# Altium schematic sheet CS_JFETOnSemiSOT23_Simple_v1.SchDoc
size A4
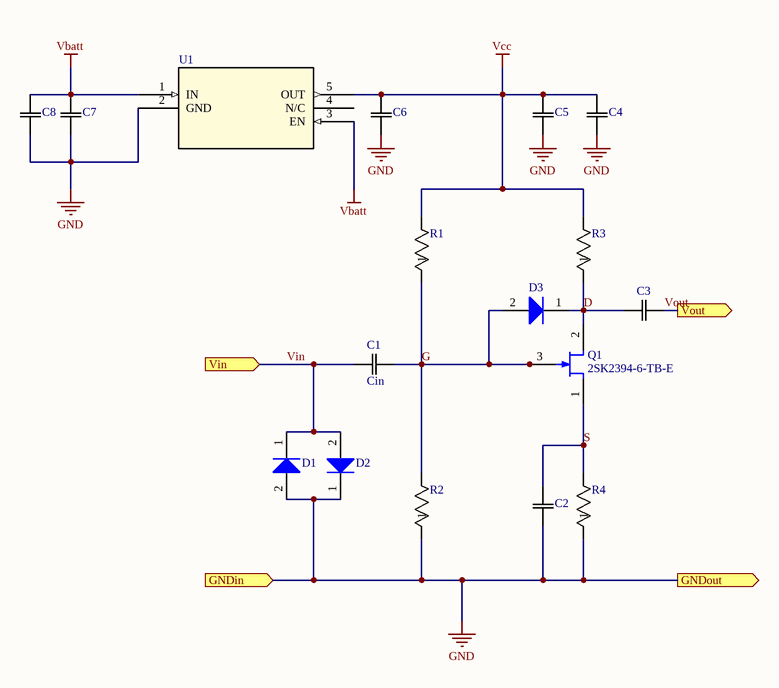
[diagram p0: CS_JFETOnSemiSOT23_Simple_v1.SchDoc]

## Parts
C1  Cin  [C0201]
C2  (no value)  [C0201]
C3  (no value)  [C0201]
C4  (no value)  [CAP_CBR_0201]
C5  (no value)  [CAP_CBR_0201]
C6  (no value)  [YAG_CC0402]
C7  (no value)  [YAG_CC0402]
C8  (no value)  [YAG_CC0402]
D1  (no value)  [INF-SOD323_V]
D2  (no value)  [INF-SOD323_V]
D3  (no value)  [INF-SOD323_V]
Q1  2SK2394-6-TB-E  [ONSC-CP-3-318AN_A_V]
R1  (no value)  [RES_RC0201_P6XP3]
R2  (no value)  [RES_RC0201_P6XP3]
R3  (no value)  [RES_RC0201_P6XP3]
R4  (no value)  [RES_RC0201_P6XP3]
U1  (no value)  [DBV5]

## Ports
GNDin (in), GNDout (out), Vin (in), Vout (out)

## Nets
GND: C2.1 C4.1 C5.1 C6.1 C7.1 C8.1 D1.2(A) D2.1(K) R2.1 R4.1 U1.2(GND) ; port GNDin, port GNDout
Vbatt: C7.2 C8.2 U1.1(IN) U1.3(EN)
Vcc: C4.2 C5.2 C6.2 R1.2 R3.2 U1.5(OUT)
D: C3.1 D3.1(K) Q1.2(D) R3.1
G: C1.2 D3.2(A) Q1.3(G) R1.1 R2.2
S: C2.2 Q1.1(S) R4.2
Vin: C1.1 D1.1(K) D2.2(A) ; port Vin
Vout: C3.2 ; port Vout

Not connected (* = marked no-connect by the designer): U1 4(N/C)

## Library data of the parts
C1-C3 = C0201C270J3GACTU: No Description Available; Vendor: Kemet; Built_By: EMA_UL_Team; Type: DEV; Manufacturer_Part_Number: C0201C270J3GACTU; Copyright: Copyright (C) 2018 Accelerated Designs. All rights reserved; RefDes: RefDes; Value: Value
C4 C5 = CBR02C399C3GAC: No Description Available; Vendor: KEMET; Built_By: EMA_UL_Team; Type: DEV; Manufacturer_Part_Number: CBR02C399C3GAC; Copyright: Copyright (C) 2018 Accelerated Designs. All rights reserved; RefDes: RefDes; Value: Value
C6-C8 = CC0402KRX7R9BB10: No Description Available; Manufacturer_Part_Number: CC0402KRX7R9BB103; Vendor: Yageo; Built_By: EMA_UL_Team; Type: DEV; Copyright: Copyright (C) 2018 Accelerated Designs. All rights reserved; RefDes: RefDes; Value: Value
D1-D3 = BAT15-03W: Single Silicon Schottky Diode, 110 mA IF Max, SOD32, Green; Manufacturer: Infineon; CT (typ): 0.26 pF; Green: yes; Group: RF Mixer; IF (max): 110 mA; VF (typ): 0.23 V; VR (max): 4 V; DatasheetVersion: Jun-2011; PackageReference: SOD323; PackageDescription: 2-Pin Small Outline Diode Package, 1.25 x 1.7 mm Body; Supplier 1: Mouser; Supplier Part Number 1: N/A; Configuration: Single; Mounting Technology: Surface Mount; PartNumber: BAT15-03W; ComponentLink1Description: Manufacturer URL; ComponentLink1URL: http://www.infineon.com/; ComponentLink2Description: Datasheet; ComponentLink2URL: http://www.infineon.com/dgdl/bat15series.pdf?folderId=db3a304314dca3890114ff6812070b44&fileId=db3a304314dca3890114ff6b74ca0b48&location=en.Products.RF.RF_Mixer___Detector_Schottky_Diodes.DATASHEET.bat15series.pdf; ComponentLink3Description: Package Specification; ComponentLink3URL: http://www.infineon.com/dgdl/SOD323-Package_Overview.pdf?folderId=db3a30431936bc4b011952aab84f3bbe&fileId=db3a30431936bc4b011952beed653be3
Q1 = 2SK2394-6-TB-E: N-Channel JFET, 15 V, 10 to 20 mA, 38 mS, 3-Pin CP, Pb-Free, Tape and Reel; Manufacturer: On Semiconductor; Channel Polarity: N Channel; IDSS Max (uA): 20000; IDSS Min (uA): 10000; PackageReference: CP-3-318AN_A; PackageDescription: 3-Pin Small Outline Transistor, Body 2.9 x 1.5 mm, Pitch 0.95 mm; Supplier 1: Digi-Key; Supplier Part Number 1: 2SK2394-6-TB-E-ND; Supplier 2: Mouser; Supplier Part Number 2: 863-2SK2394-6-TB-E; Packing: Tape and Reel; RoHS: Pb-Free; Mounting Technology: Surface Mount; PartNumber: 2SK2394-6-TB-E; ComponentLink1Description: Manufacturer URL; ComponentLink1URL: http://www.onsemi.com/; ComponentLink2Description: Datasheet; ComponentLink2URL: http://www.onsemi.com/pub_link/Collateral/EN4839-D.PDF; ComponentLink3Description: Package Specification; ComponentLink3URL: http://www.onsemi.com/pub_link/Collateral/EN6619-D.PDF
R1-R4 = RC0201FR-0718KL: No Description Available; Vendor: Yageo; Built_By: EMA_Anthony; Copyright: Copyright (C) 2018 Accelerated Designs. All rights reserved; Manufacturer_Part_Number: RC0201FR-0718KL; RefDes: RefDes; Type: DEV; Value: Value
U1 = LP5907MFX-3.3/NO: No Description Available; Manufacturer_Part_Number: LP5907MFX-3.3/NOPB; Vendor: Texas Instruments; Built_By: EMA_UL_Team; Copyright: Copyright (C) 2018 Accelerated Designs. All rights reserved; RefDes: RefDes; Type: DEV; Value: Value